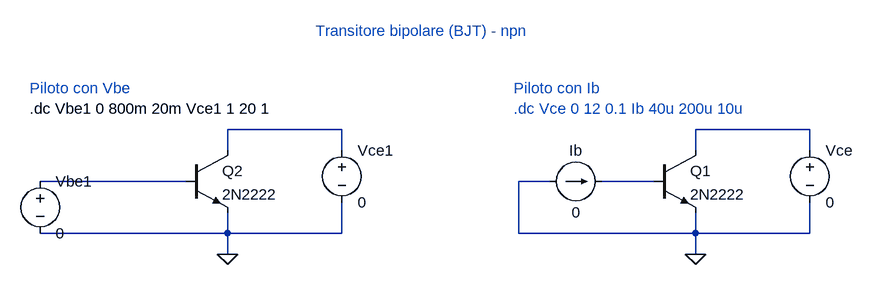
[diagram p0: schematic 08. transitore bipolare BJT.asc]
08. transitore bipolare BJT.asc, the LTspice schematic file:
Version 4
SHEET 1 880 680
WIRE -304 64 -480 64
WIRE 416 64 240 64
WIRE -480 96 -480 64
WIRE -304 96 -304 64
WIRE 240 96 240 64
WIRE 416 96 416 64
WIRE -544 144 -768 144
WIRE 16 144 -32 144
WIRE 176 144 96 144
WIRE -480 224 -480 192
WIRE -480 224 -768 224
WIRE -304 224 -304 176
WIRE -304 224 -480 224
WIRE -32 224 -32 144
WIRE 240 224 240 192
WIRE 240 224 -32 224
WIRE 416 224 416 176
WIRE 416 224 240 224
WIRE -480 256 -480 224
WIRE 240 256 240 224
FLAG 240 256 0
FLAG -480 256 0
SYMBOL npn2 176 96 R0
SYMATTR InstName Q1
SYMATTR Value 2N2222
SYMBOL voltage 416 80 R0
WINDOW 123 0 0 Left 0
WINDOW 39 0 0 Left 0
SYMATTR InstName Vce
SYMATTR Value 0
SYMBOL current 16 144 R270
WINDOW 0 32 40 VTop 2
WINDOW 3 -32 40 VBottom 2
SYMATTR InstName Ib
SYMATTR Value 0
SYMBOL npn2 -544 96 R0
SYMATTR InstName Q2
SYMATTR Value 2N2222
SYMBOL voltage -304 80 R0
WINDOW 123 0 0 Left 0
WINDOW 39 0 0 Left 0
SYMATTR InstName Vce1
SYMATTR Value 0
SYMBOL voltage -768 128 R0
SYMATTR InstName Vbe1
SYMATTR Value 0
TEXT -40 32 Left 2 ;.dc Vce 0 12 0.1 Ib 40u 200u 10u
TEXT -344 -88 Left 2 ;Transitore bipolare (BJT) - npn
TEXT -784 32 Left 2 !.dc Vbe1 0 800m 20m Vce1 1 20 1
TEXT -784 0 Left 2 ;Piloto con Vbe
TEXT -40 0 Left 2 ;Piloto con Ib

The netlist it stands for:
* 08. transitore bipolare BJT.asc
Q1 N002 N004 0 0 2N2222
Vce N002 0 0
Ib 0 N004 0
Q2 N001 N003 0 0 2N2222
Vce1 N001 0 0
Vbe1 N003 0 0
.model NPN NPN
.model PNP PNP
.lib standard.bjt
* .dc Vce 0 12 0.1 Ib 40u 200u 10u
* Transitore bipolare (BJT) - npn
.dc Vbe1 0 800m 20m Vce1 1 20 1
* Piloto con Vbe
* Piloto con Ib
.backanno
.end